# EAGLE schematic schematic (EAGLE 8.2.0)
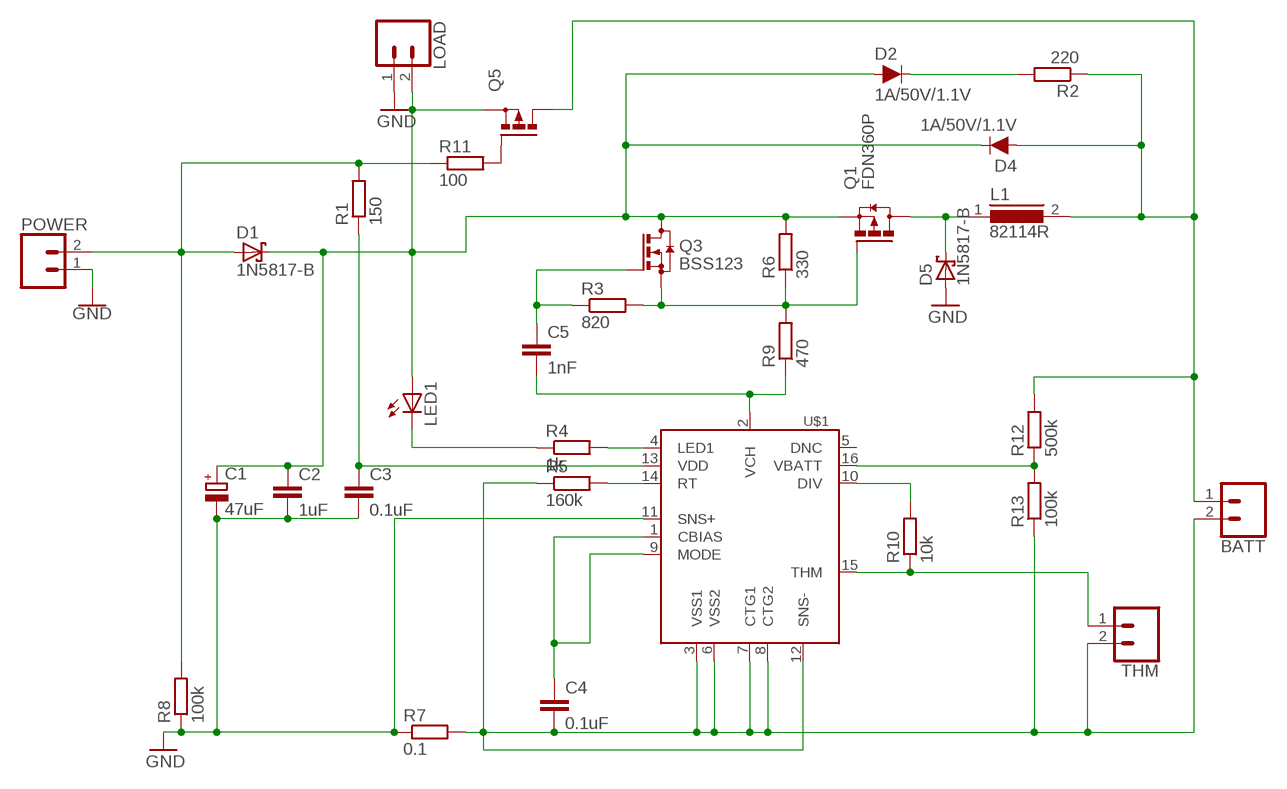
[diagram p0: schematic, sheet 1]

## Parts
BATT  CONN_02POLAR  [MOLEX-1X2]
C1  47uF  CPOL-EUE2.5-6  [E2,5-6]
C2  1uF  C-EU025-025X050  [C025-025X050]
C3  0.1uF  C-EU025-025X050  [C025-025X050]
C4  0.1uF  C-EU025-025X050  [C025-025X050]
C5  1nF  C-EU025-025X050  [C025-025X050]
D1  1N5817-B  [DO41-7.6]
D2  1A/50V/1.1V  DIODE-PTH  [DIODE-1N4001]
D4  1A/50V/1.1V  DIODE-PTH  [DIODE-1N4001]
D5  1N5817-B  [DO41-7.6]
L1  82114R  [82114R]
LED1  LED5MM  [LED5MM]
LOAD  CONN_02POLAR  [MOLEX-1X2]
POWER  CONN_02POLAR  [MOLEX-1X2]
Q1  FDN360P  [SUPER-SOT3]
Q3  BSS123  [SOT23]
Q5  PMOSFET_PTO220BV  [TO220BV]
R1  150  R-EU_0207/10  [0207/10]
R2  220  R-EU_0207/10  [0207/10]
R3  820  R-EU_0207/10  [0207/10]
R4  1k  R-EU_0207/10  [0207/10]
R5  160k  R-EU_0207/10  [0207/10]
R6  330  R-EU_0207/10  [0207/10]
R7  0.1  R-EU_0207/10  [0207/10]
R8  100k  R-EU_0207/10  [0207/10]
R9  470  R-EU_0207/10  [0207/10]
R10  10k  R-EU_0207/10  [0207/10]
R11  100  R-EU_0207/10  [0207/10]
R12  500k  R-EU_0207/10  [0207/10]
R13  100k  R-EU_0207/10  [0207/10]
THM  CONN_02  [1X02]
U$1  DS2715  [DS2715-SO16]

## Nets
GND: C1.- C2.2 C3.2 D5.A LOAD.1 POWER.1 R7.1 R8.1 U$1.11(SNS+)
N$1: Q5.G R11.2
N$4: BATT.2 C4.2 R5.1 R7.2 R13.1 THM.2 U$1.3(VSS1) U$1.6(VSS2) U$1.7(CTG1) U$1.8(CTG2) U$1.12(SNS-)
N$5: R10.1 THM.1 U$1.15(THM)
N$6: R10.2 U$1.10(DIV)
N$7: R12.1 R13.2 U$1.16(VBATT)
N$8: BATT.1 D4.A L1.2 Q5.D R2.1 R12.2
N$9: R4.2 U$1.4(LED1)
N$10: D5.C L1.1 Q1.3(D)
N$12: C5.2 R9.1 U$1.2(VCH)
N$13: Q1.1(G) Q3.2(S) R3.2 R6.1 R9.2
N$14: C5.1 Q3.1(G) R3.1
N$15: LED1.K(C) R4.1
N$17: D2.C R2.2
N$19: C3.1 R1.1 U$1.13(VDD)
N$20: R5.2 U$1.14(RT)
N$23: C4.1 U$1.1(CBIAS) U$1.9(MODE)
N$25: D1.A POWER.2 R1.2 R8.2 R11.1
N$26: C1.+ C2.1 D1.C D2.A D4.C LED1.A LOAD.2 Q1.2(S) Q3.3(D) Q5.S R6.2
Unconnected: U$1.5(DNC)

## Library data of the parts
BATT LOAD POWER = SparkFun-Connectors:CONN_02: Multi connection point. Often used as Generic Header-pin footprint for 0.1 inch spaced/style header connections On any of the 0.1 inch spaced packages, you can populate with these: Break Away Headers - Straight <https://www.sparkfun.com/products/116> (PRT-00116) Break Away Male Headers - Right Angle <https://www.sparkfun.com/products/553> (PRT-00553) Female Headers <https://www.sparkfun.com/products/115> (PRT-00115) Break Away Headers - Machine Pin <https://www.sparkfun.com/products/117> (PRT-00117) Break Away Female Headers - Swiss Machine Pin <https://www.sparkfun.com/products/743> (PRT-00743) For SCREWTERMINALS and SPRING TERMINALS visit here: Screw Terimnals on SparkFun.com <https://www.sparkfun.com/search/results?term=Screw+Terminals> (5mm/3.5mm/2.54mm spacing) This device is also useful as a general connection point to wire up your design to another part of your project. Our various solder wires solder well into these plated through hole pads. Hook-Up Wire - Assortment (Stranded, 22 AWG) <https://www.sparkfun.com/products/11375> (PRT-11375) Hook-Up Wire - Assortment (Solid Core, 22 AWG) <https://www.sparkfun.com/products/11367> (PRT-11367) View the entire wire category on our website here <https://www.sparkfun.com/categories/141> Special notes: Molex polarized connector foot print use with: PRT-08233 with associated crimp pins and housings. 2.54_SCREWTERM for use with PRT-10571. 3.5mm Screw Terminal footprints for PRT-08084 5mm Screw Terminal footprints for use with PRT-08432; SF_ID: PRT-09918
C1 = rcl:CPOL-EU: POLARIZED CAPACITOR, European symbol
C2-C5 = rcl:C-EU: CAPACITOR, European symbol
D1 D5 = diode:1N581*: 1.0A SCHOTTKY BARRIER RECTIFIER Source: http://www.diodes.com/datasheets/ds23001.pdf
D2 D4 = SparkFun-DiscreteSemi:DIODE: Diode These are standard reverse protection diodes and small signal diodes. SparkFun Products: SparkFun SparkPunk Sound Kit <https://www.sparkfun.com/products/11177> SparkFun ESP8266 Thing <https://www.sparkfun.com/products/13231>; PROD_ID: DIO-09176
L1 = inductors:82114R: INDUCTOR
LED1 = led:LED: LED OSRAM: - CHIPLED LG R971, LG N971, LY N971, LG Q971, LY Q971, LO R971, LY R971 LH N974, LH R974 LS Q976, LO Q976, LY Q976 LO Q996 - Hyper CHIPLED LW Q18S LB Q993, LB Q99A, LB R99A - SideLED LS A670, LO A670, LY A670, LG A670, LP A670 LB A673, LV A673, LT A673, LW A673 LH A674 LY A675 LS A676, LA A676, LO A676, LY A676, LW A676 LS A679, LY A679, LG A679 - Hyper Micro SIDELED® LS Y876, LA Y876, LO Y876, LY Y876 LT Y87S - SmartLED LW L88C, LW L88S LB L89C, LB L89S, LG L890 LS L89K, LO L89K, LY L89K LS L896, LA L896, LO L896, LY L896 - TOPLED LS T670, LO T670, LY T670, LG T670, LP T670 LSG T670, LSP T670, LSY T670, LOP T670, LYG T670 LG T671, LOG T671, LSG T671 LB T673, LV T673, LT T673, LW T673 LH T674 LS T676, LA T676, LO T676, LY T676, LB T676, LH T676, LSB T676, LW T676 LB T67C, LV T67C, LT T67C, LS T67K, LO T67K, LY T67K, LW E67C LS E67B, LA E67B, LO E67B, LY E67B, LB E67C, LV E67C, LT E67C LW T67C LS T679, LY T679, LG T679 LS T770, LO T770, LY T770, LG T770, LP T770 LB T773, LV T773, LT T773, LW T773 LH T774 LS E675, LA E675, LY E675, LS T675 LS T776, LA T776, LO T776, LY T776, LB T776 LHGB T686 LT T68C, LB T68C - Hyper Mini TOPLED® LB M676 - Mini TOPLED Santana® LG M470 LS M47K, LO M47K, LY M47K Source: http://www.osram.convergy.de LUXEON: - LUMILED® LXK2-PW12-R00, LXK2-PW12-S00, LXK2-PW14-U00, LXK2-PW14-V00 LXK2-PM12-R00, LXK2-PM12-S00, LXK2-PM14-U00 LXK2-PE12-Q00, LXK2-PE12-R00, LXK2-PE12-S00, LXK2-PE14-T00, LXK2-PE14-U00 LXK2-PB12-K00, LXK2-PB12-L00, LXK2-PB12-M00, LXK2-PB14-N00, LXK2-PB14-P00, LXK2-PB14-Q00 LXK2-PR12-L00, LXK2-PR12-M00, LXK2-PR14-Q00, LXK2-PR14-R00 LXK2-PD12-Q00, LXK2-PD12-R00, LXK2-PD12-S00 LXK2-PH12-R00, LXK2-PH12-S00 LXK2-PL12-P00, LXK2-PL12-Q00, LXK2-PL12-R00 Source: www.luxeon.com KINGBRIGHT: KA-3528ASYC Source: www.kingbright.com
Q1 = transistor-power:FDN360P: Single P-Channel, PowerTrench (R) MOSFET Source: http://www.fairchildsemi.com/ds/FD/FDN360P.pdf
Q3 = transistor-small-signal:BSS123: N-CHANNEL MOS FET
Q5 = transistor-power:PMOSFET_P: Power MOSFET P-Channel
R1-R13 = rcl:R-EU_: RESISTOR, European symbol
THM = SparkFun-Connectors:CONN_02: Multi connection point. Often used as Generic Header-pin footprint for 0.1 inch spaced/style header connections On any of the 0.1 inch spaced packages, you can populate with these: Break Away Headers - Straight <https://www.sparkfun.com/products/116> (PRT-00116) Break Away Male Headers - Right Angle <https://www.sparkfun.com/products/553> (PRT-00553) Female Headers <https://www.sparkfun.com/products/115> (PRT-00115) Break Away Headers - Machine Pin <https://www.sparkfun.com/products/117> (PRT-00117) Break Away Female Headers - Swiss Machine Pin <https://www.sparkfun.com/products/743> (PRT-00743) For SCREWTERMINALS and SPRING TERMINALS visit here: Screw Terimnals on SparkFun.com <https://www.sparkfun.com/search/results?term=Screw+Terminals> (5mm/3.5mm/2.54mm spacing) This device is also useful as a general connection point to wire up your design to another part of your project. Our various solder wires solder well into these plated through hole pads. Hook-Up Wire - Assortment (Stranded, 22 AWG) <https://www.sparkfun.com/products/11375> (PRT-11375) Hook-Up Wire - Assortment (Solid Core, 22 AWG) <https://www.sparkfun.com/products/11367> (PRT-11367) View the entire wire category on our website here <https://www.sparkfun.com/categories/141> Special notes: Molex polarized connector foot print use with: PRT-08233 with associated crimp pins and housings. 2.54_SCREWTERM for use with PRT-10571. 3.5mm Screw Terminal footprints for PRT-08084 5mm Screw Terminal footprints for use with PRT-08432
U$1 = ic-ds2715-nimh-charger:DS2715